# EAGLE design ESQUEMATIC (EAGLE 9.6.2)
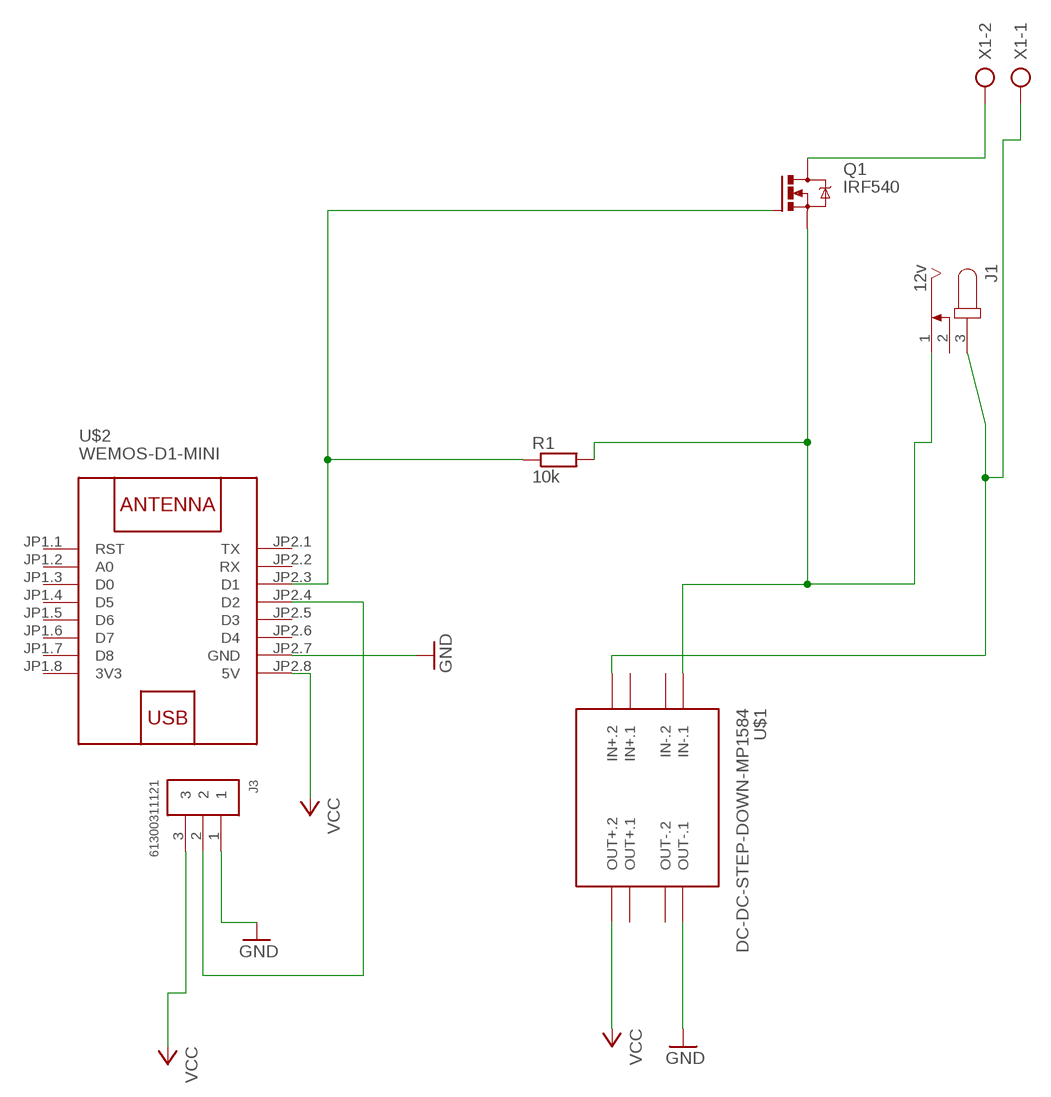
[diagram p0: schematic, sheet 1]

## Parts
J1  12v  JACK-PLUG0  [SPC4077]
J3  61300311121  [61300311121]
Q1  IRF540  [TO220BV]
R1  10k  R-EU_0204/7  [0204/7]
U$1  DC-DC-STEP-DOWN-MP1584  [DC-DC-STEP-DOWN-MP1584]
U$2  WEMOS-D1-MINI  [WEMOS-D1-MINI]
X1  AK300/2  [AK300/2]

## Nets
GND: J3.1 U$1.OUT-.1 U$2.JP2.7(GND)
N$3 [12v]: J1.3 U$1.IN+.2 X1.1
N$4 [12v]: J1.1 Q1.S R1.2 U$1.IN-.1
N$5 [12v]: Q1.D X1.2
N$6: Q1.G R1.1 U$2.JP2.3(D1)
N$9: J3.2 U$2.JP2.4(D2)
VCC: J3.3 U$1.OUT+.2 U$2.JP2.8(5V)
Unconnected: J1.2 U$1.IN+.1 U$1.IN-.2 U$1.OUT+.1 U$1.OUT-.2 U$2.JP1.1(RST) U$2.JP1.2(A0) U$2.JP1.3(D0) U$2.JP1.4(D5) U$2.JP1.5(D6) U$2.JP1.6(D7) U$2.JP1.7(D8) U$2.JP2.1(TX) U$2.JP2.2(RX) U$2.JP2.5(D3) U$2.JP2.6(D4)

## Power pins joined to a net without a drawn wire
3V3: U$2.JP1.8(3V3)

## Library data of the parts
J1 = con-jack:JACK-PLUG: DC POWER JACK Power Jack, DC, Right Angle, Through Hole, Rated 5A at 16VDC, PC Terminals Distributor: Farnell (www.Farnell.de) Drawing: 84N1161.pdf / 84N1162.pdf Manufacturer: SPC Technology (www.spctechnology.com) Type: SPC4077 / SPC 4078; OC_FARNELL: unknown; OC_NEWARK: unknown
J3 = Headers:61300311121: CONN HEADER VERT 3POS 2.54MM Manufacturer's datasheet <https://katalog.we-online.de/em/datasheet/6130xx11121.pdf>; CREATED_BY: PCBLayout.com; DIGI_KEY_PART_NUMBER: 732-5316-ND; MANUFACTURER: Wurth Electronics Inc.; MPN: 61300311121
Q1 = transistor-power:IRF540: HEXFET Power MOSFET
R1 = rcl:R-EU_: RESISTOR, European symbol; SPICEPREFIX: R
U$1 = estpdown:DC-DC-STEP-DOWN-MP1584: DC/DC Step-Down Regulator based on MP1584 chip MP1584 datasheet available here: http://www.haoyuelectronics.com/Attachment/MP1584/MP1584.pdf Click here to find device on ebay.com <http://www.ebay.com/sch/mp1584+module>
U$2 = estpdown:WEMOS-D1-MINI: WEMOS D1 mini: Mini Wi-Fi Board based on ESP-8266 device More details can be found here: https://www.wemos.cc/product/d1-mini.html Click here to find device on ebay.com <http://www.ebay.com/sch/wemos+d1+mini+nodemcu>
X1 = con-ptr500:AK300/2: CONNECTOR; OC_FARNELL: unknown; OC_NEWARK: unknown

## Net classes
0 default: width 0.508 mm, drill 1.27 mm
1 12v: width 0.889 mm

## Board
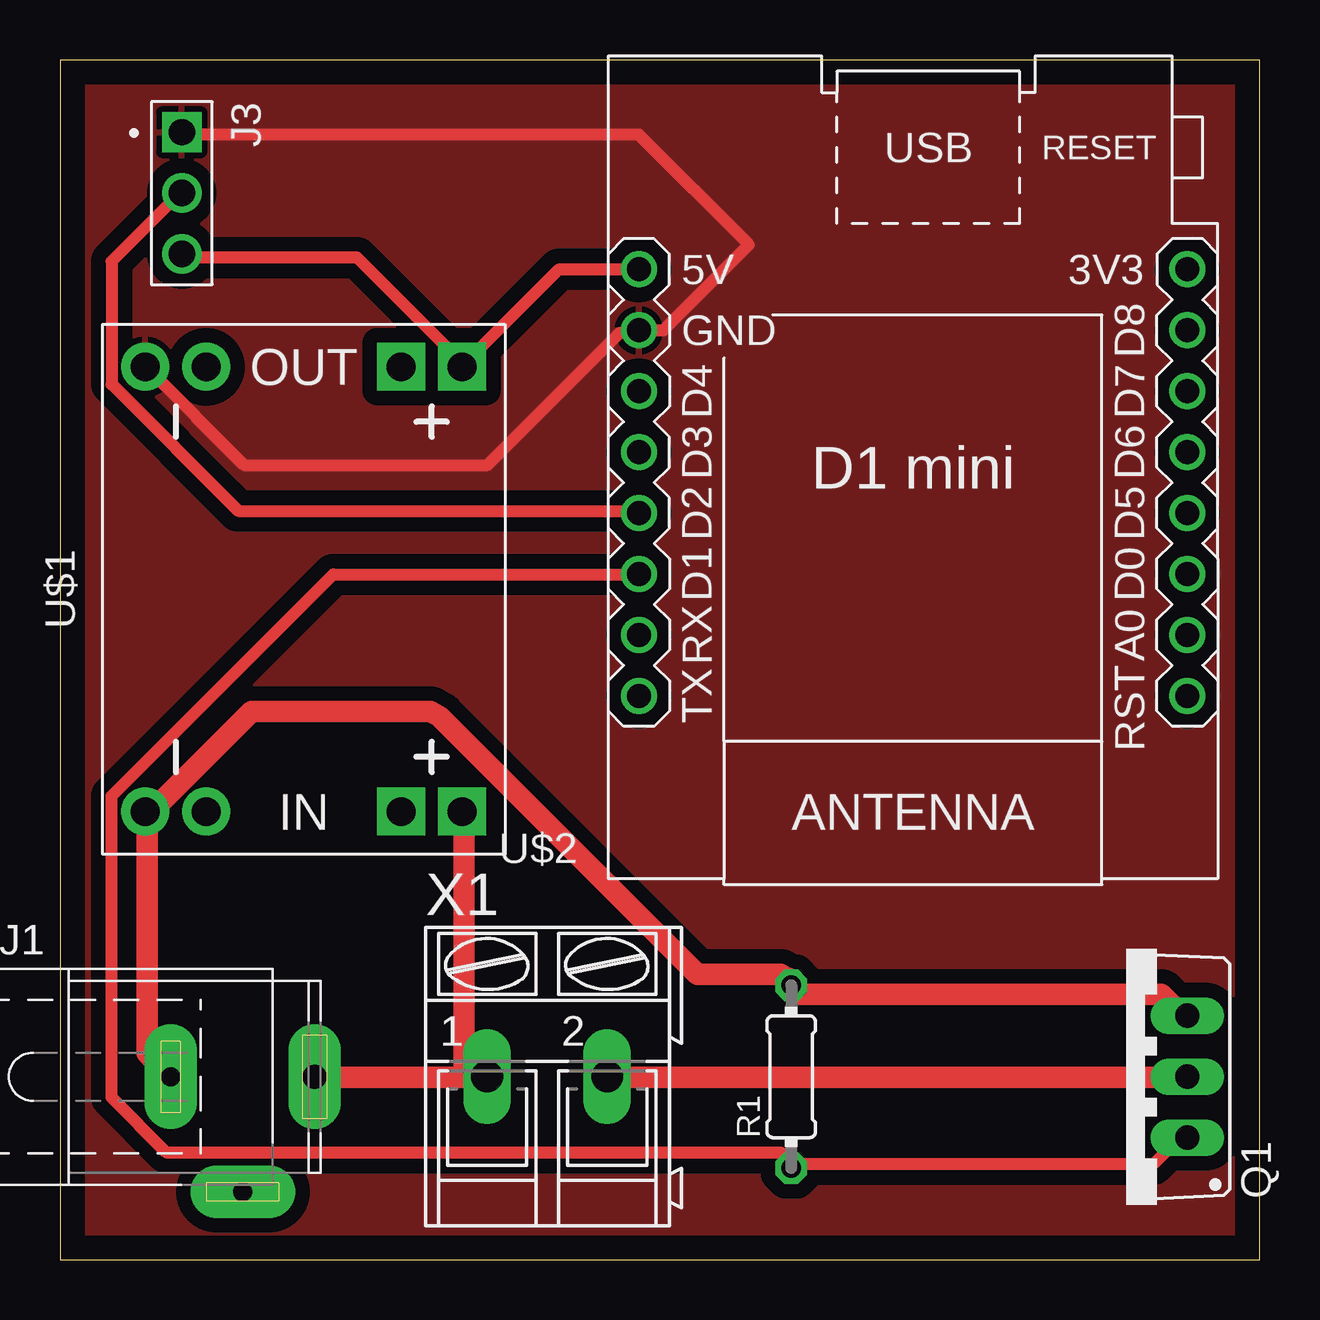
[diagram p1: board, top side]

Size 50 x 50 mm. Coordinates in mm from the lower left corner, seen from the top.
Outline: 0,0 50,0 50,50 0,50 0,0
Copper layers (1*16): Top 0.035mm / dielectric 1.5mm / Bottom 0.035mm
Design rules "default": minimum track width 6mil, minimum drill 0.35mm, track to track 6mil, track to pad 6mil, pad to pad 6mil, via to via 6mil, smd to smd 6mil, copper to edge 40mil, drill to drill 6mil, minimum pad ring 10mil, minimum via ring 8mil, stop-mask expansion 4mil, vias tented up to drill 0mil, thermal gap 10mil

### Footprints (pad centres in the part's own frame; a part is rotated, then mirrored left to right if it is on the bottom)
SPC4077 = drill 0.8 pad 2.184 long: 1 -3,0; 2 0,-4.8 | drill 1 pad 2.184 long: 3 3,0
61300311121 = drill 1.1 square: 1 -2.54,0 | drill 1.1: 2 0,0; 3 2.54,0
TO220BV = drill 1.016 long: D 0,-2.54; G -2.54,-2.54; S 2.54,-2.54
0204/7 = drill 0.813 octagon: 1 -3.81,0; 2 3.81,0
DC-DC-STEP-DOWN-MP1584 = drill 1.2 pad 2 square: IN+.1 -9.271,-4.064; IN+.2 -9.271,-6.604; OUT+.1 9.271,-4.064; OUT+.2 9.271,-6.604 | drill 1.2 pad 2: IN-.1 -9.271,6.604; IN-.2 -9.271,4.064; OUT-.1 9.271,6.604; OUT-.2 9.271,4.064
WEMOS-D1-MINI = drill 1: JP1.1 -11.43,9.525; JP1.2 -11.43,6.985; JP1.3 -11.43,4.445; JP1.4 -11.43,1.905; JP1.5 -11.43,-0.635; JP1.6 -11.43,-3.175; JP1.7 -11.43,-5.715; JP1.8 -11.43,-8.255; JP2.1 11.43,9.525; JP2.2 11.43,6.985; JP2.3 11.43,4.445; JP2.4 11.43,1.905; JP2.5 11.43,-0.635; JP2.6 11.43,-3.175; JP2.7 11.43,-5.715; JP2.8 11.43,-8.255
AK300/2 = drill 1.321 long: 1 -2.515,0; 2 2.489,0

### Placement (x,y rotation side)
J1  7.62,7.62 0 top
J3  5.08,44.45 270 top
Q1  44.45,7.62 90 top
R1  30.48,7.62 90 top
U$1  10.16,27.94 90 top
U$2  35.56,33.02 180 top
X1  20.32,7.62 0 top

### Tracks (layer width: path | path; a pad name or v marks a point on that pad's centre or on a via)
GND
  Top 0.508: U$1.OUT-.1 3.63,37.15 7.66,33.12 17.83,33.12 23.34,38.63 24.11,38.63 U$2.JP2.7 25.15,38.73 28.71,42.3 24.12,46.89 5.12,46.89 J3.1
  pour Top (isolate 0.61): 0,49.53 50.8,49.53 50.8,0 0,0
N$3
  Top 0.889: 10.73,7.59 J1.3 11.06,7.59 17.67,7.59 X1.1 16.84,7.92 16.84,18.33 U$1.IN+.2 16.68,18.66
N$4
  Top 0.889: J1.1 4.46,7.76 3.63,8.59 3.63,18.66 U$1.IN-.1 3.96,18.82 7.99,22.85 15.46,22.85 15.85,22.62 26.58,11.89 30.05,11.89 R1.2 | 30.56,11.39 R1.2 | 46.9,10.24 Q1.S 46.56,10.4 45.9,11.06 30.87,11.06 R1.2 | 30.39,11.72 R1.2
N$5
  Top 0.889: 46.97,7.59 Q1.D 46.56,7.59 22.95,7.59 X1.2
N$6
  Top 0.508: Q1.G 46.84,5.23 | 47.23,5.12 Q1.G | Q1.G 46.72,5.12 45.57,3.96 30.54,3.96 R1.1 30.38,4.13 30.05,4.46 4.46,4.46 2.15,6.77 2.15,19.32 11.39,28.56 23.94,28.56 U$2.JP2.3
N$9
  Top 0.508: U$2.JP2.4 24.11,31.2 7.43,31.2 2.15,36.49 2.15,41.6 4.95,44.41 J3.2
VCC
  Top 0.508: U$2.JP2.8 20.8,41.27 16.84,37.31 U$1.OUT+.2 16.68,37.48 12.38,41.77 5.12,41.77 J3.3